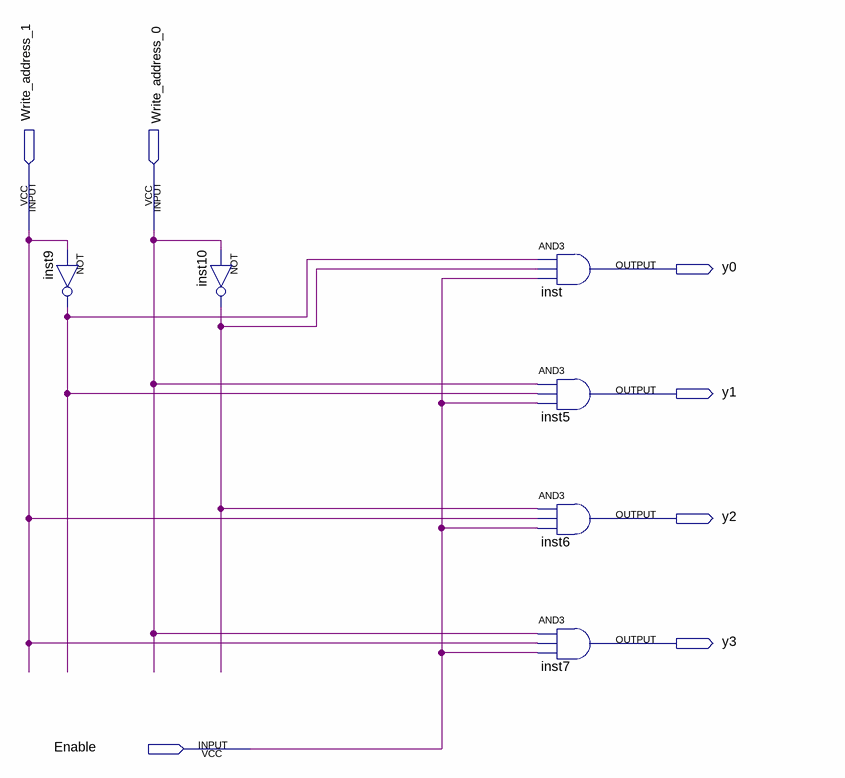
[diagram p0: schematic sheet]
// Quartus schematic 2to4decoder.bdf as structural Verilog: 6 symbols, 7 pins
module \2to4decoder  (
  input  Write_address_1,
  input  Write_address_0,
  input  Enable,
  output y0,
  output y1,
  output y2,
  output y3
);

  wire inst9_out, inst10_out;

  not inst9 (inst9_out, Write_address_1);
  not inst10 (inst10_out, Write_address_0);
  and inst (y0, inst9_out, inst10_out, Enable);
  and inst5 (y1, Write_address_0, inst9_out, Enable);
  and inst6 (y2, inst10_out, Write_address_1, Enable);
  and inst7 (y3, Write_address_0, Write_address_1, Enable);
endmodule
